# EAGLE schematic spi_v2 (EAGLE 7.3.0)
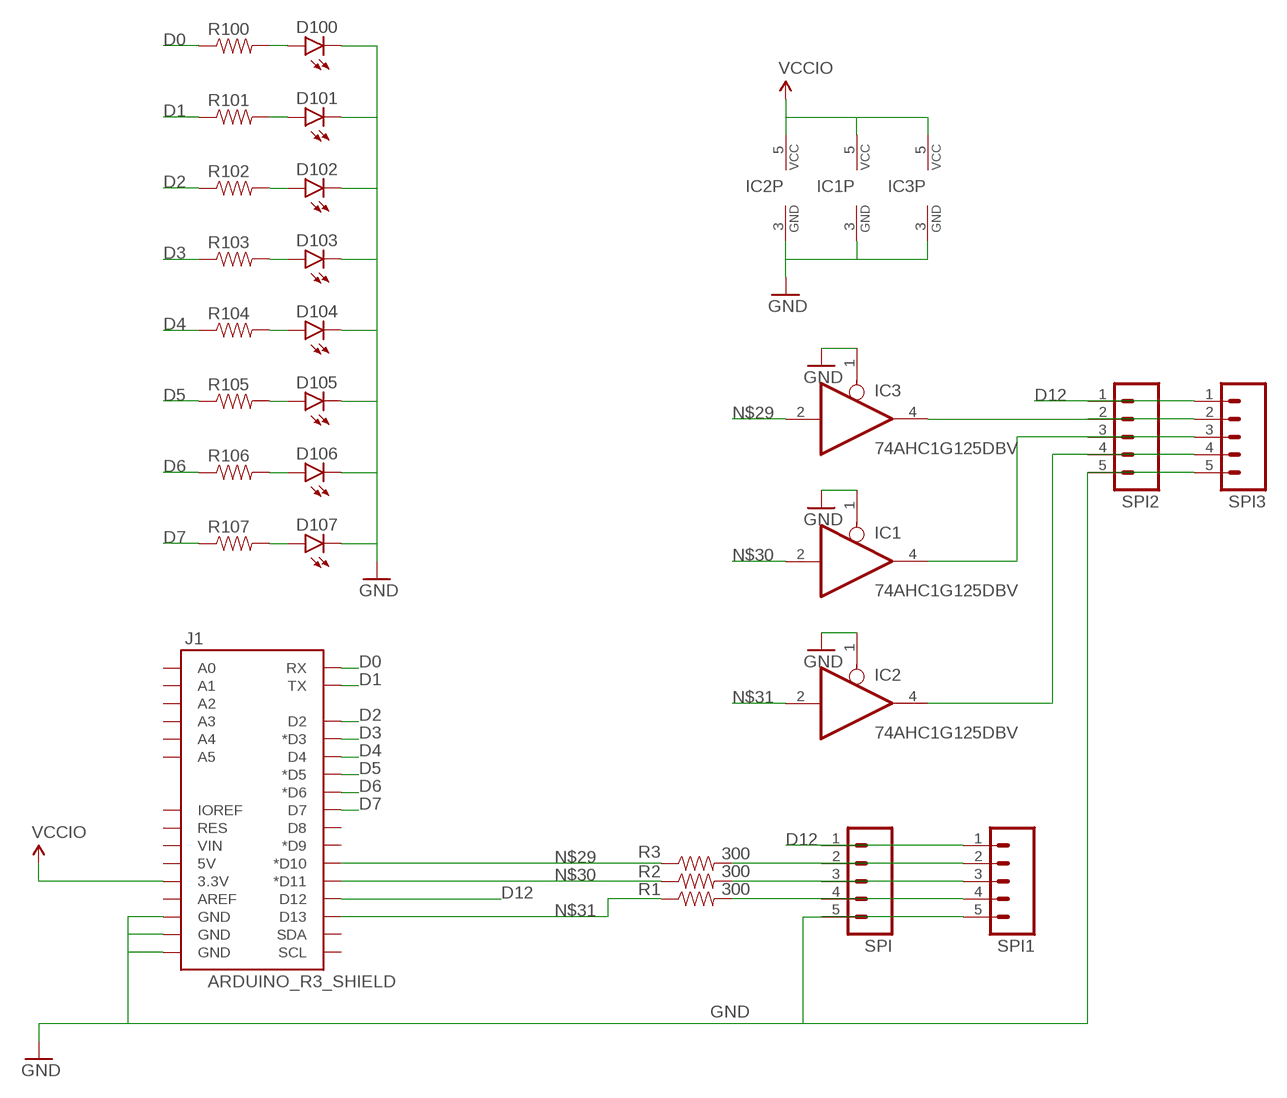
[diagram p0: schematic, sheet 1]

## Parts
D100  LED-FKIT-1206  [FKIT-LED-1206]
D101  LED-FKIT-1206  [FKIT-LED-1206]
D102  LED-FKIT-1206  [FKIT-LED-1206]
D103  LED-FKIT-1206  [FKIT-LED-1206]
D104  LED-FKIT-1206  [FKIT-LED-1206]
D105  LED-FKIT-1206  [FKIT-LED-1206]
D106  LED-FKIT-1206  [FKIT-LED-1206]
D107  LED-FKIT-1206  [FKIT-LED-1206]
IC1  74AHC1G125DBV  [SOT23-5]
IC2  74AHC1G125DBV  [SOT23-5]
IC3  74AHC1G125DBV  [SOT23-5]
J1  ARDUINO_R3_SHIELD  [UNO_R3_SHIELD]
R1  300  RESISTORPTH-1/4W  [AXIAL-0.4]
R2  300  RESISTORPTH-1/4W  [AXIAL-0.4]
R3  300  RESISTORPTH-1/4W  [AXIAL-0.4]
R100  RESISTOR0805-RES  [0805]
R101  RESISTOR0805-RES  [0805]
R102  RESISTOR0805-RES  [0805]
R103  RESISTOR0805-RES  [0805]
R104  RESISTOR0805-RES  [0805]
R105  RESISTOR0805-RES  [0805]
R106  RESISTOR0805-RES  [0805]
R107  RESISTOR0805-RES  [0805]
SPI  M05PTH_LONGPADS  [1X05_LONGPADS]
SPI1  M05PTH_LONGPADS  [1X05_LONGPADS]
SPI2  M05PTH_LONGPADS  [1X05_LONGPADS]
SPI3  M05PTH_LONGPADS  [1X05_LONGPADS]

## Nets
D0: J1.RX R100.1
D1: J1.TX R101.1
D2: J1.D2 R102.1
D3: J1.D3(*D3) R103.1
D4: J1.D4 R104.1
D5: J1.D5(*D5) R105.1
D6: J1.D6(*D6) R106.1
D7: J1.D7 R107.1
D12: J1.D12 SPI1.1 SPI2.1 SPI3.1 SPI.1
GND: D100.C D101.C D102.C D103.C D104.C D105.C D106.C D107.C IC1.1(OE) IC1.3(GND) IC2.1(OE) IC2.3(GND) IC3.1(OE) IC3.3(GND) J1.GND@0(GND) J1.GND@1(GND) J1.GND@2(GND) SPI1.5 SPI2.5 SPI3.5 SPI.5
N$1: D107.A R107.2
N$2: IC3.4(O) SPI2.2 SPI3.2
N$4: R1.P$2 SPI1.4 SPI.4
N$5: R2.P$2 SPI1.3 SPI.3
N$6: R3.P$2 SPI1.2 SPI.2
N$8: D106.A R106.2
N$9: D105.A R105.2
N$10: D104.A R104.2
N$11: D103.A R103.2
N$12: D102.A R102.2
N$13: D100.A R100.2
N$14: D101.A R101.2
N$23: IC1.4(O) SPI2.3 SPI3.3
N$24: IC2.4(O) SPI2.4 SPI3.4
N$29: IC3.2(I) J1.D10(*D10) R3.P$1
N$30: IC1.2(I) J1.D11(*D11) R2.P$1
N$31: IC2.2(I) J1.D13 R1.P$1
N$32: IC1.5(VCC) IC2.5(VCC) IC3.5(VCC) J1.3.3V ; supply symbol labelled VCCIO
Unconnected: J1.5V J1.A0 J1.A1 J1.A2 J1.A3 J1.A4 J1.A5 J1.AREF J1.D8 J1.D9(*D9) J1.IOREF J1.RES J1.SCL J1.SDA J1.VIN

## Library data of the parts
D100-D107 = SparkFun-LED:LED: LEDs Standard schematic elements and footprints for 5mm, 3mm, 1206, and 0603 sized LEDs. 5mm - Spark Fun Electronics SKU : COM-00529 (and others)
IC1-IC3 = 74xx-little-us:74*1G125: Single Bus Buffer Gate with 3-State Output
J1 = SparkFun-Boards:ARDUINO_R3_SHIELD: Shield form compatible with the Arduino Uno R3.
R1-R3 R100-R107 = SparkFun-Passives:RESISTOR: Resistor Basic schematic elements and footprints for 0603, 1206, and PTH resistors.
SPI SPI1-SPI3 = SparkFun-Connectors:M05: Header 5 Standard 5-pin 0.1" header. Use with straight break away headers (SKU : PRT-00116), right angle break away headers (PRT-00553), swiss pins (PRT-00743), machine pins (PRT-00117), and female headers (PRT-00115). Molex polarized connector foot print use with SKU : PRT-08230 with associated crimp pins and housings.